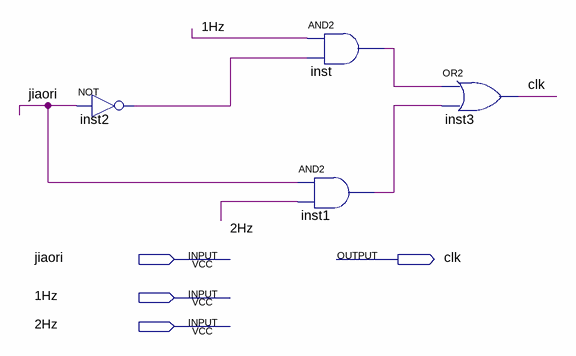
[diagram p0: schematic sheet]
// Quartus schematic jiaori.bdf as structural Verilog: 4 symbols, 4 pins
module jiaori (
  input  jiaori,
  input  \1Hz ,
  input  \2Hz ,
  output clk
);

  wire inst1_out, inst2_out, inst_out;

  not inst2 (inst2_out, jiaori);
  and inst (inst_out, \1Hz , inst2_out);
  and inst1 (inst1_out, jiaori, \2Hz );
  or inst3 (clk, inst_out, inst1_out);
endmodule
